# Altium schematic sheet ResetCircuit.SchDoc
size A4
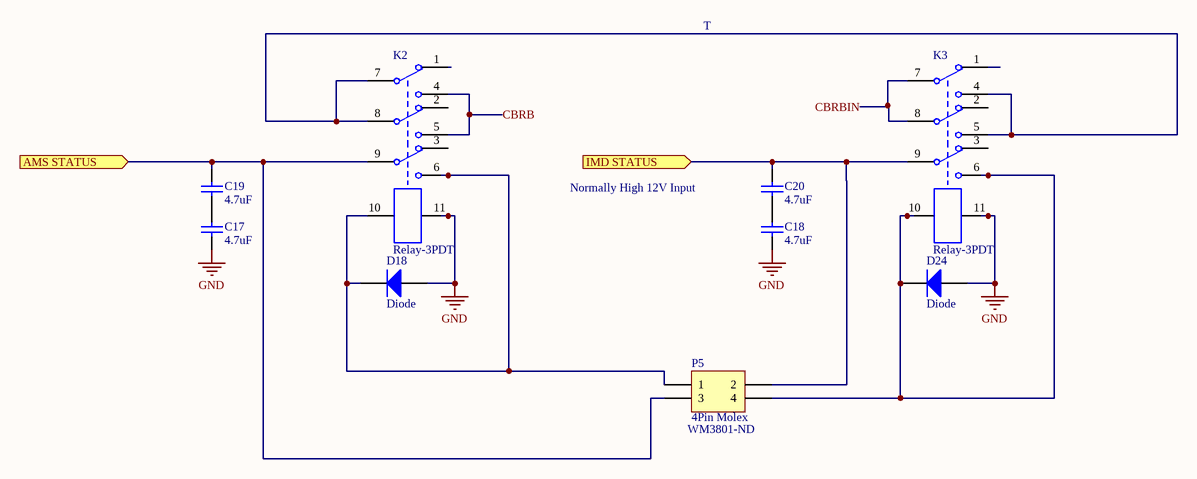
[diagram p0: ResetCircuit.SchDoc]

## Parts
C17  4.7uF  [CAPC3216X170N]
C18  4.7uF  [CAPC3216X170N]
C19  4.7uF  [CAPC3216X170N]
C20  4.7uF  [CAPC3216X170N]
D18  Diode  [DO-220AA]
D24  Diode  [DO-220AA]
K2  Relay-3PDT  [55.13]
K3  Relay-3PDT  [55.13]
P5  4Pin Molex  Supplier Part Number: WM3801-ND  [4Pin Molex]

## Ports
AMS STATUS (in), IMD STATUS (in)

## Nets
GND: C17.1 C18.1 D18.1(A) D24.1(A) K2.11 K3.11
AMS STATUS: C19.2 K2.9 P5.3 ; port AMS STATUS
CBRB: K2.4 K2.5
CBRBIN: K3.7 K3.8
IMD STATUS: C20.2 K3.9 P5.2 ; port IMD STATUS
NetC17_2: C17.2 C19.1
NetC18_2: C18.2 C20.1
NetD18_2: D18.2(K) K2.6 K2.10 P5.1
NetD24_2: D24.2(K) K3.6 K3.10 P5.4
NetK2_7: K2.7 K2.8 K3.4 K3.5

Not connected (* = marked no-connect by the designer): K2 1 2 3; K3 1 2 3

## Notes on the sheet
- T
- Normally High 12V Input

## Library data of the parts
C17-C20 = Cap Semi: Capacitor (Semiconductor SIM Model); Manufacturer: Murata; Manufacturer Part Number: GRM31MR71H105KA88L; Material: Ceramic; Tolerance: 10%; Voltage Rating: 50V; Capacitance: 1uF; Dielectric: X7R; Published: 8-Jun-2000; LatestRevisionDate: 29-May-2009; LatestRevisionNote: IPC-7351 Footprint Added.; PackageReference: C1206; Publisher: Altium Limited; PackageDescription: Chip Capacitor; Value: 4.7uF; Supplier Part Number: 1276-1055-1-ND; Supplier 1: Digi-Key; Stock 1: 0; Mount: Surface Mount; Case/Package: 1206; Number of Pins: 2; Case Code (Metric): 3216; Case Code (Imperial): 1206; Min Operating Temperature: -55°C; Max Operating Temperature: 125°C; Package Quantity: 1; Packaging: Tape and Reel; Voltage Rating (DC): 50V; Termination: SMD/SMT; Voltage: 50V; Length: 3.2mm; Height: 1.15mm; Width: 0.063inch; Thickness: 0.049inch; Depth: 1.6mm; REACH SVHC: No SVHC; Lead Free: Lead Free; ComponentLink1URL: https://datasheet.ciiva.com/16379/product-16379616.pdf; ComponentLink1Description: https://datasheet.ciiva.com/16379/product-16379616.pdf; ComponentLink2URL: https://datasheet.ciiva.com/14116/nmgrm-data-en-14116709.pdf; ComponentLink2Description: https://datasheet.ciiva.com/14116/nmgrm-data-en-14116709.pdf; ComponentLink3URL: https://datasheet.ciiva.com/22703/608985-22703384.pdf; ComponentLink3Description: https://datasheet.ciiva.com/22703/608985-22703384.pdf; ComponentLink4URL: https://datasheet.ciiva.com/3777/42grm31mr71h105ka8823-3777081.pdf; ComponentLink4Description: https://datasheet.ciiva.com/3777/42grm31mr71h105ka8823-3777081.pdf; ComponentLink5URL: https://datasheet.ciiva.com/6270/partnumbering-e-01-6270398.pdf; ComponentLink5Description: https://datasheet.ciiva.com/6270/partnumbering-e-01-6270398.pdf; ComponentLink6URL: https://datasheet.ciiva.com/6270/partnumbering-e-01-6270399.pdf; ComponentLink6Description: https://datasheet.ciiva.com/6270/partnumbering-e-01-6270399.pdf; ComponentLink7URL: https://datasheet.ciiva.com/29199/455056-da-01-en-vs-kondensator-1206-29199449.pdf; ComponentLink7Description: https://datasheet.ciiva.com/29199/455056-da-01-en-vs-kondensator-1206-29199449.pdf; ComponentLink8URL: https://datasheet.ciiva.com/29202/450923-da-01-de-vs-chip-kond-1206-1-0-uf-10pr-50-0v-x7r-29202718.pdf; ComponentLink8Description: https://datasheet.ciiva.com/29202/450923-da-01-de-vs-chip-kond-1206-1-0-uf-10pr-50-0v-x7r-29202718.pdf; Supplier 2: Digi-Key
D18 D24 = Diode: Default Diode; Published: 8-Jun-2000; LatestRevisionDate: 17-Jul-2002; LatestRevisionNote: Re-released for DXP Platform.; PackageVersion: Sep-1996; PackageReference: SMC; Publisher: Altium Limited; PackageDescription: DO-214-AB/SMC; 2 C-Bend Leads; Body 7.9 x 5.9 mm, inc. leads (LxW); Code_JEDEC: DO-214-AB; Supplier 1: Digi-Key; Supplier 2: Digi-Key; Supplier Part Number: SS1P3L-M3/84AGICT-ND
K2 K3 = Relay-3PDT: ComponentLink1Description: Manufacturer Link; ComponentLink2Description: Datasheet